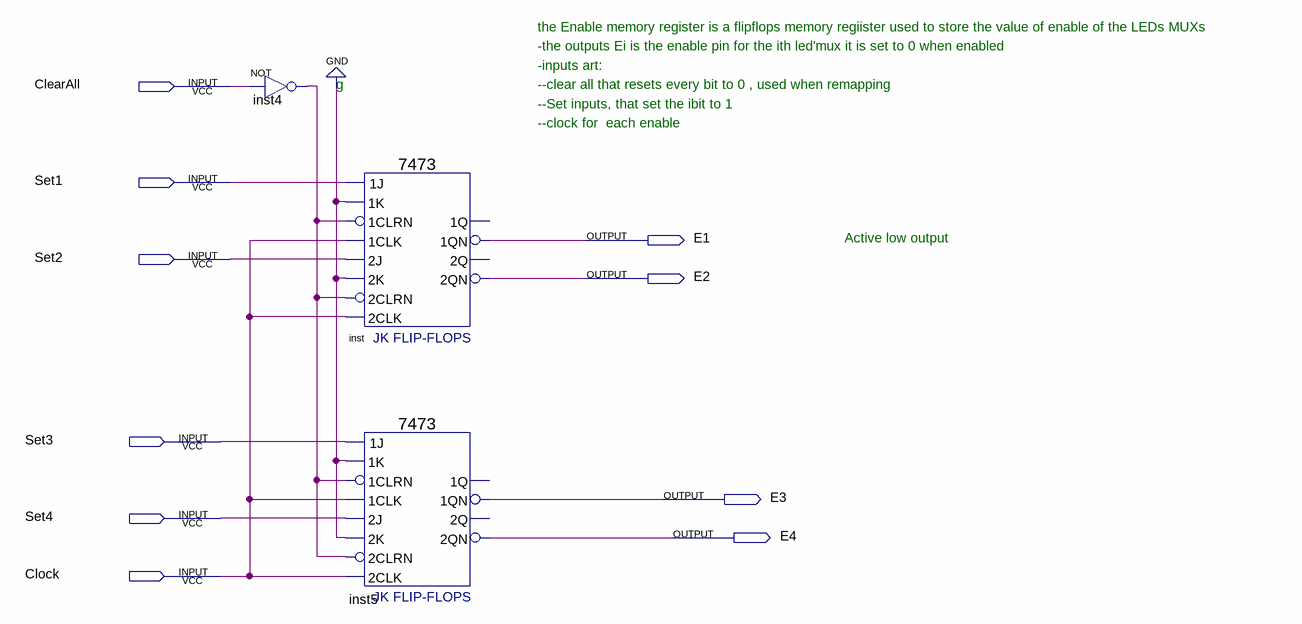
[diagram p0: schematic sheet]
// Quartus schematic EnableMemory.bdf as structural Verilog: 3 symbols, 10 pins
module EnableMemory (
  input  ClearAll,
  input  Set1,
  input  Set2,
  input  Set3,
  input  Set4,
  input  Clock,
  output E1,
  output E2,
  output E3,
  output E4
);

  wire inst4_out;

  not inst4 (inst4_out, ClearAll);
  \7473  inst (
    .\1J (Set1), .\1CLRN (inst4_out), .\1K (1'b0), .\1CLK (Clock), .\2J (Set2), .\2CLK (Clock),
    .\2CLRN (inst4_out), .\2K (1'b0), .\1QN (E1), .\2QN (E2));  // open: 2Q, 1Q
  \7473  inst5 (
    .\1J (Set3), .\1CLRN (inst4_out), .\1K (1'b0), .\1CLK (Clock), .\2J (Set4), .\2CLK (Clock),
    .\2CLRN (inst4_out), .\2K (1'b0), .\1QN (E3), .\2QN (E4));  // open: 2Q, 1Q

  // Notes on the sheet:
  //   the Enable memory register is a flipflops memory regiister used to store the value of enable of the LEDs MUXs
  //   -the outputs Ei is the enable pin for the ith led'mux it is set to 0 when enabled
  //   -inputs art:
  //   g
  //   --clear all that resets every bit to 0 , used when remapping
  //   --Set inputs, that set the ibit to 1
  //   --clock for  each enable
  //   Active low output
endmodule
